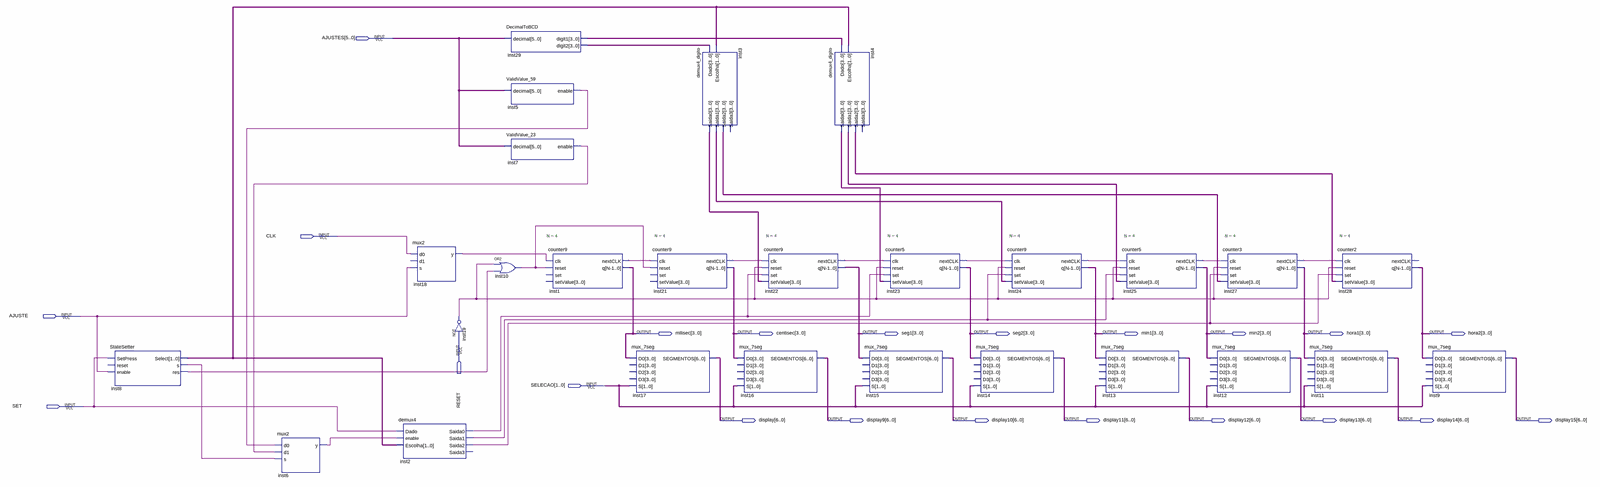
[diagram p0: schematic sheet, whole]
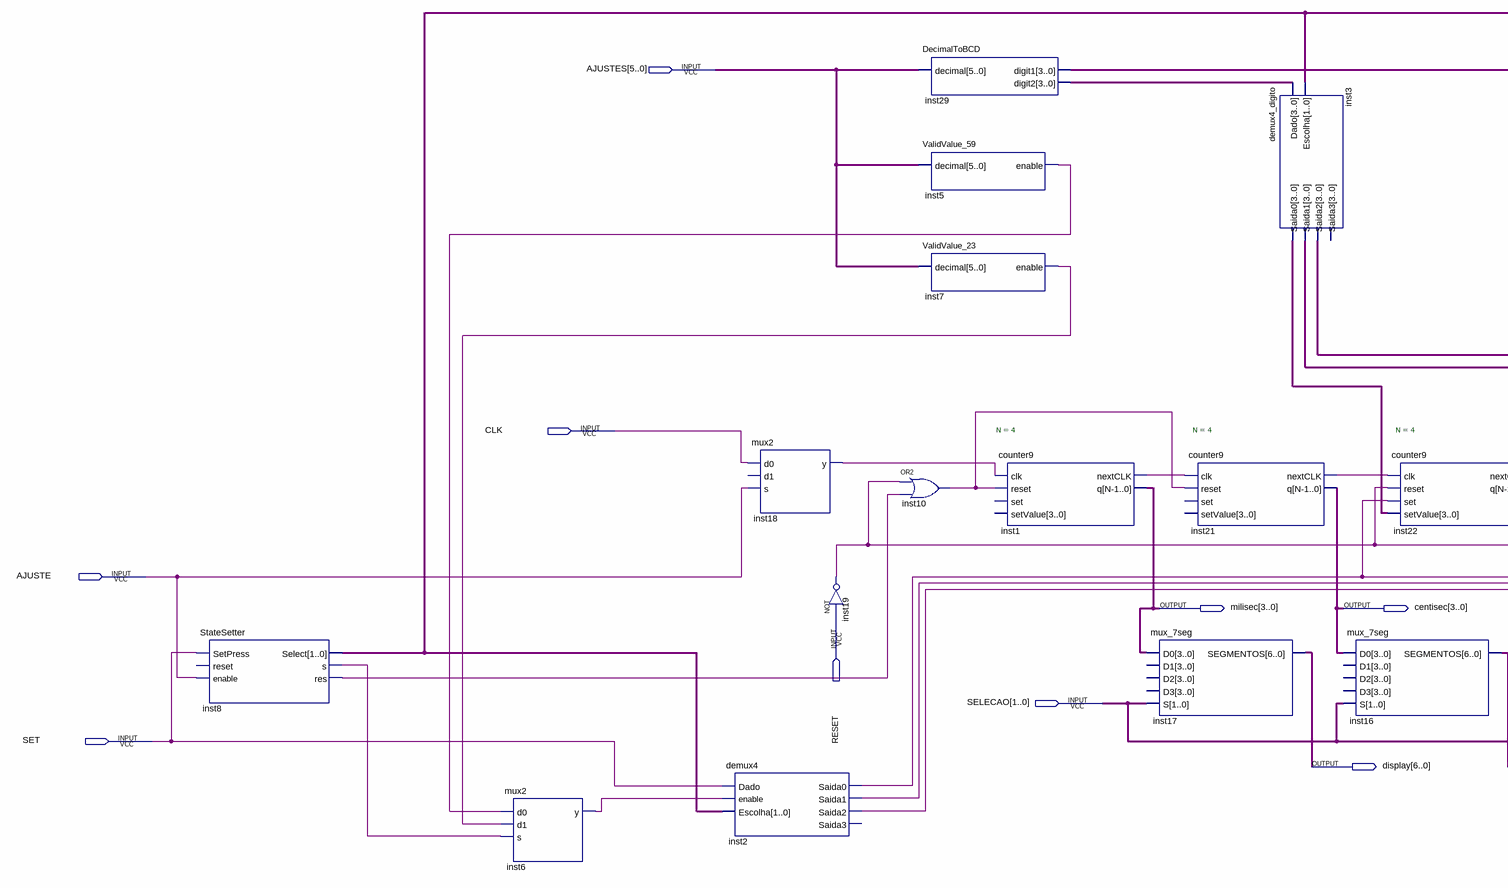
[diagram p1: schematic sheet, left part]
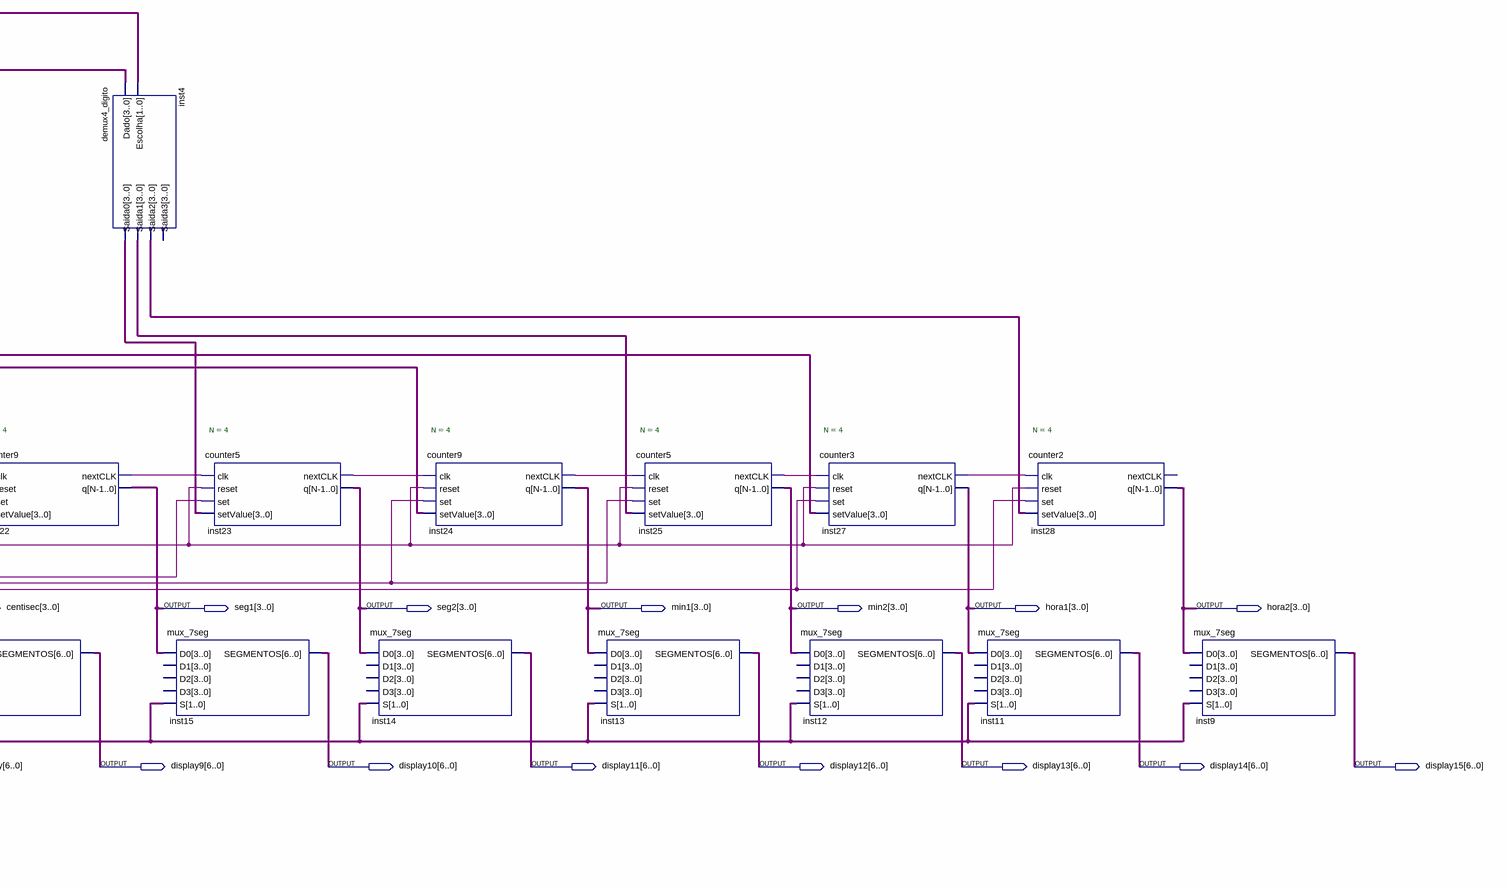
[diagram p2: schematic sheet, right part]
// Quartus schematic ProjetoFinal.bdf as structural Verilog: 27 symbols, 22 pins
module ProjetoFinal (
  input  [5:0] AJUSTES,
  input  CLK,
  input  AJUSTE,
  input  RESET,
  input  [1:0] SELECAO,
  input  SET,
  output [3:0] milisec,
  output [3:0] centisec,
  output [3:0] seg1,
  output [3:0] seg2,
  output [3:0] min1,
  output [3:0] min2,
  output [3:0] hora1,
  output [3:0] hora2,
  output [6:0] display,
  output [6:0] display9,
  output [6:0] display10,
  output [6:0] display11,
  output [6:0] display12,
  output [6:0] display13,
  output [6:0] display14,
  output [6:0] display15
);

  wire inst1_nextclk, inst2_saida0, inst2_saida1, inst2_saida2, inst5_enable, inst6_y, inst7_enable,
       inst8_res, inst8_s, inst10_out, inst18_y, inst19_out, inst21_nextclk, inst22_nextclk, inst23_nextclk,
       inst24_nextclk, inst25_nextclk, inst27_nextclk;
  wire [1:0] inst8_select;
  wire [3:0] inst3_saida0, inst3_saida1, inst3_saida2, inst4_saida0, inst4_saida1, inst4_saida2,
       inst29_digit1, inst29_digit2;

  StateSetter inst8 (
    .SetPress(SET), .enable(AJUSTE), .Select(inst8_select), .s(inst8_s), .res(inst8_res));  // open: reset
  mux2 inst6 (.d0(inst5_enable), .d1(inst7_enable), .s(inst8_s), .y(inst6_y));
  mux2 inst18 (.d0(CLK), .s(AJUSTE), .y(inst18_y));  // open: d1
  demux4 inst2 (
    .Dado(SET), .enable(inst6_y), .Escolha(inst8_select), .Saida0(inst2_saida0), .Saida1(inst2_saida1),
    .Saida2(inst2_saida2));  // open: Saida3
  not inst19 (inst19_out, RESET);
  or inst10 (inst10_out, inst19_out, inst8_res);
  DecimalToBCD inst29 (.decimal(AJUSTES), .digit1(inst29_digit1), .digit2(inst29_digit2));
  ValidValue_59 inst5 (.decimal(AJUSTES), .enable(inst5_enable));
  ValidValue_23 inst7 (.decimal(AJUSTES), .enable(inst7_enable));
  counter9 #(.N(4)) inst1 (
    .clk(inst18_y), .reset(inst10_out), .nextCLK(inst1_nextclk), .q(milisec));  // open: set, setValue
  mux_7seg inst17 (.D0(milisec), .S(SELECAO), .SEGMENTOS(display));  // open: D1, D2, D3
  counter9 #(.N(4)) inst21 (
    .clk(inst1_nextclk), .reset(inst10_out), .nextCLK(inst21_nextclk), .q(centisec));  // open: set, setValue
  demux4_digito inst3 (
    .Dado(inst29_digit2), .Escolha(inst8_select), .Saida0(inst3_saida0), .Saida1(inst3_saida1),
    .Saida2(inst3_saida2));  // open: Saida3
  mux_7seg inst16 (.D0(centisec), .S(SELECAO), .SEGMENTOS(display9));  // open: D1, D2, D3
  counter9 #(.N(4)) inst22 (
    .clk(inst21_nextclk), .reset(inst19_out), .set(inst2_saida0), .setValue(inst3_saida0),
    .nextCLK(inst22_nextclk), .q(seg1));
  demux4_digito inst4 (
    .Dado(inst29_digit1), .Escolha(inst8_select), .Saida0(inst4_saida0), .Saida1(inst4_saida1),
    .Saida2(inst4_saida2));  // open: Saida3
  mux_7seg inst15 (.D0(seg1), .S(SELECAO), .SEGMENTOS(display10));  // open: D1, D2, D3
  counter5 #(.N(4)) inst23 (
    .clk(inst22_nextclk), .reset(inst19_out), .set(inst2_saida0), .setValue(inst4_saida0),
    .nextCLK(inst23_nextclk), .q(seg2));
  mux_7seg inst14 (.D0(seg2), .S(SELECAO), .SEGMENTOS(display11));  // open: D1, D2, D3
  counter9 #(.N(4)) inst24 (
    .clk(inst23_nextclk), .reset(inst19_out), .set(inst2_saida1), .setValue(inst3_saida1),
    .nextCLK(inst24_nextclk), .q(min1));
  mux_7seg inst13 (.D0(min1), .S(SELECAO), .SEGMENTOS(display12));  // open: D1, D2, D3
  counter5 #(.N(4)) inst25 (
    .clk(inst24_nextclk), .reset(inst19_out), .set(inst2_saida1), .setValue(inst4_saida1),
    .nextCLK(inst25_nextclk), .q(min2));
  counter3 #(.N(4)) inst27 (
    .clk(inst25_nextclk), .reset(inst19_out), .set(inst2_saida2), .setValue(inst3_saida2),
    .nextCLK(inst27_nextclk), .q(hora1));
  mux_7seg inst12 (.D0(min2), .S(SELECAO), .SEGMENTOS(display13));  // open: D1, D2, D3
  mux_7seg inst11 (.D0(hora1), .S(SELECAO), .SEGMENTOS(display14));  // open: D1, D2, D3
  counter2 #(.N(4)) inst28 (
    .clk(inst27_nextclk), .reset(inst19_out), .set(inst2_saida2), .setValue(inst4_saida2), .q(hora2));  // open: nextCLK
  mux_7seg inst9 (.D0(hora2), .S(SELECAO), .SEGMENTOS(display15));  // open: D1, D2, D3
endmodule
